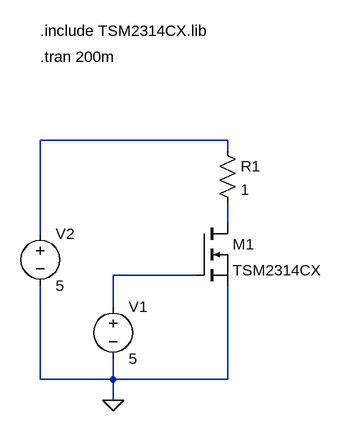
[diagram p0: schematic mosfet_test.asc]
mosfet_test.asc, the LTspice schematic file:
Version 4
SHEET 1 880 680
WIRE 144 -16 -144 -16
WIRE 144 0 144 -16
WIRE 144 112 144 80
WIRE -144 128 -144 -16
WIRE 96 192 -32 192
WIRE -32 240 -32 192
WIRE -144 352 -144 208
WIRE -32 352 -32 320
WIRE -32 352 -144 352
WIRE 144 352 144 208
WIRE 144 352 -32 352
WIRE -32 384 -32 352
FLAG -32 384 0
SYMBOL nmos 96 112 R0
SYMATTR InstName M1
SYMATTR Value TSM2314CX
SYMBOL voltage -32 224 R0
WINDOW 123 0 0 Left 2
WINDOW 39 0 0 Left 2
SYMATTR InstName V1
SYMATTR Value 5
SYMBOL res 128 -16 R0
SYMATTR InstName R1
SYMATTR Value 1
SYMBOL voltage -144 112 R0
WINDOW 123 0 0 Left 2
WINDOW 39 0 0 Left 2
SYMATTR InstName V2
SYMATTR Value 5
TEXT -144 -184 Left 2 !.include TSM2314CX.lib
TEXT -144 -144 Left 2 !.tran 200m

The netlist it stands for:
* mosfet_test.asc
M1 N002 N003 0 0 TSM2314CX
V1 N003 0 5
R1 N001 N002 1
V2 N001 0 5
.model NMOS NMOS
.model PMOS PMOS
.lib standard.mos
.include TSM2314CX.lib
.tran 200m
.backanno
.end